# Altium schematic sheet Led_block.SchDoc: LED_PER_SWITCH
size A4; Date: 16.12.2024; Author: MGasiorowski; SheetNumber: 2; SheetTotal: 2; Model: PSC_1; PageSetup: Record=PageOptions|CenterHorizontal=True|CenterVertical=True|PrintScale=0.52|XCorrection=1.00|YCorrection=1.00|PrintKind=1|BorderSize=5000000|LeftOffset=0|BottomOffset=0|Orientation=2|PaperLength=4200|PaperWidth=2970|Scale=100|PaperSource=7|PrintQuality=600|MediaType=1|DitherType=10|PaperKind=A3|PrintScaleMode=1
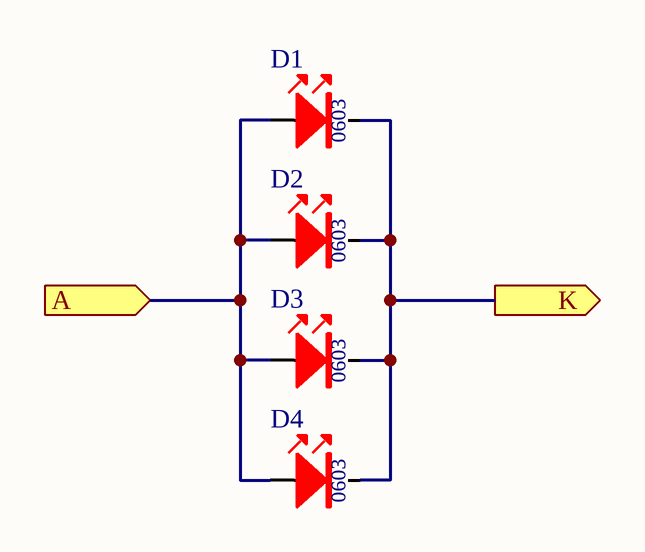
[diagram p0: Led_block.SchDoc]

## Parts
D1  SCH_Footprint: 0603  [OL_0603_1608]  (hidden comment: Red LED 0603)
D2  SCH_Footprint: 0603  [OL_0603_1608]  (hidden comment: Red LED 0603)
D3  SCH_Footprint: 0603  [OL_0603_1608]  (hidden comment: Red LED 0603)
D4  SCH_Footprint: 0603  [OL_0603_1608]  (hidden comment: Red LED 0603)

## Ports
A (in), K (out)

## Nets
A: D1.2(A) D2.2(A) D3.2(A) D4.2(A) ; port A
K: D1.1(K) D2.1(K) D3.1(K) D4.1(K) ; port K

## Notes on the sheet
- Title:
- Sheet:
- of
- Author:
- Model:
- Document Number:
- Checked by:
- Iss-Rev:
- Approved by:
- Date:
- File name:

## Library data of the parts
D1-D4 = OL_R_0603_LTST-C193KRKT-5A: LED_RED; Manufacturer: Lite-On; Value: LTST-C193KRKT-5A; Part Number: OL_R_0603_LTST-C193KRKT-5A; HelpURL: https://pl.mouser.com/datasheet/2/239/LTST-C193KRKT-5A-1141706.pdf; Manufacturer Part Number: LTST-C193KRKT-5A; Supplier 1: TME; Supplier Part Number 1: LTST-C193KRKT-5A; Supplier 2: RS Components; Supplier Part Number 2: 6921041; Supplier 3: Farnell; Supplier 4: Mouser; Supplier Part Number 4: 859-LTSTC193KRKT5A; Supplier 5: Digi-Key; Supplier Part Number 5: 160-1830-1-ND; Supplier 6: LCSC